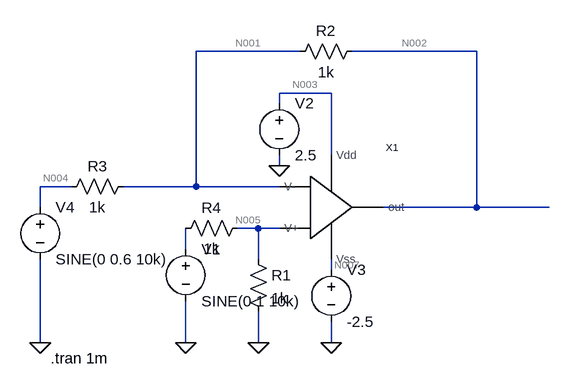
[diagram p0: schematic 2f.asc]
2f.asc, the LTspice schematic file:
Version 4
SHEET 1 880 680
WIRE 224 -176 64 -176
WIRE 496 -176 304 -176
WIRE 272 -112 192 -112
WIRE 192 -96 192 -112
WIRE 272 -16 272 -112
WIRE 192 0 192 -16
WIRE -128 32 -176 32
WIRE 64 32 64 -176
WIRE 64 32 -48 32
WIRE 192 32 64 32
WIRE -176 64 -176 32
WIRE 496 64 496 -176
WIRE 496 64 352 64
WIRE 608 64 496 64
WIRE 160 96 128 96
WIRE 192 96 160 96
WIRE 48 128 48 96
WIRE 160 144 160 96
WIRE 272 160 272 144
WIRE -176 272 -176 144
WIRE 48 272 48 208
WIRE 160 272 160 224
WIRE 272 272 272 240
FLAG 48 272 0
FLAG 272 272 0
FLAG 192 0 0
FLAG -176 272 0
FLAG 160 272 0
SYMBOL voltage 48 112 R0
WINDOW 123 24 44 Left 2
WINDOW 39 0 0 Left 0
SYMATTR InstName V1
SYMATTR Value SINE(0 1 10k)
SYMBOL voltage 192 -112 R0
WINDOW 123 0 0 Left 0
WINDOW 39 0 0 Left 0
SYMATTR InstName V2
SYMATTR Value 2.5
SYMBOL voltage 272 144 R0
WINDOW 123 0 0 Left 0
WINDOW 39 0 0 Left 0
SYMATTR InstName V3
SYMATTR Value -2.5
SYMBOL OPAMP 160 64 R0
SYMATTR InstName X1
SYMBOL voltage -176 48 R0
WINDOW 123 24 44 Left 2
WINDOW 39 0 0 Left 0
SYMATTR InstName V4
SYMATTR Value SINE(0 0.6 10k)
SYMBOL res 144 128 R0
SYMATTR InstName R1
SYMATTR Value 1k
SYMBOL res 320 -192 R90
WINDOW 0 0 56 VBottom 2
WINDOW 3 32 56 VTop 2
SYMATTR InstName R2
SYMATTR Value 1k
SYMBOL res -32 16 R90
WINDOW 0 0 56 VBottom 2
WINDOW 3 32 56 VTop 2
SYMATTR InstName R3
SYMATTR Value 1k
SYMBOL res 144 80 R90
WINDOW 0 0 56 VBottom 2
WINDOW 3 32 56 VTop 2
SYMATTR InstName R4
SYMATTR Value 1k
TEXT -160 296 Left 2 !.tran 1m

The netlist it stands for:
* 2f.asc
V1 N006 0 SINE(0 1 10k)
V2 N003 0 2.5
V3 N007 0 -2.5
XX1 N003 N007 N001 N005 N002 OPAMP  ; pins Vdd Vss V- V+ out
V4 N004 0 SINE(0 0.6 10k)
R1 N005 0 1k
R2 N002 N001 1k
R3 N001 N004 1k
R4 N005 N006 1k
.tran 1m
.backanno
.end

* Results of the author's LTspice run, read from the files saved beside the schematic
* Operating Point, zero values left out:
*   V(n003) = 2.5 V
*   V(n007) = -2.5 V
*   V(n001) = 47.59 µV
*   V(n002) = 95.18 µV
*   I(R2) = 47.59 nA
*   I(R3) = 47.59 nA
*   I(V2) = -188.5 µA
*   I(V3) = 188.4 µA
*   I(V4) = 47.59 nA
*   Ix(x1:VDD) = 188.5 µA
*   Ix(x1:VSS) = -188.4 µA
*   Ix(x1:OUT) = -47.59 nA
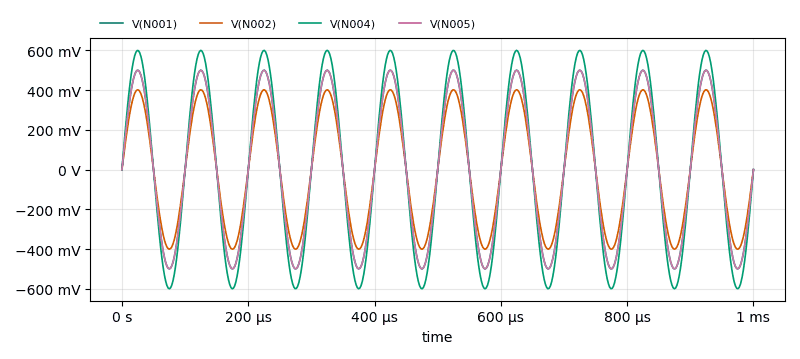
[diagram p1: Transient Analysis of 2f.asc, plotted from the saved traces]
* Transient Analysis, 1 run:
*   V(N001): min -500.1 mV, max 500.6 mV, average 142.4 µV, rms 353.8 mV, last -441.2 µV
*   V(N002): min -400.7 mV, max 401.7 mV, average 285.3 µV, rms 283.7 mV, last -882.4 µV
*   V(N004): min -600 mV, max 600 mV, average -570.1 nV, rms 424.3 mV, last 0 V
*   V(N005): min -499.5 mV, max 499.5 mV, average -457.3 nV, rms 353.2 mV, last 0 V